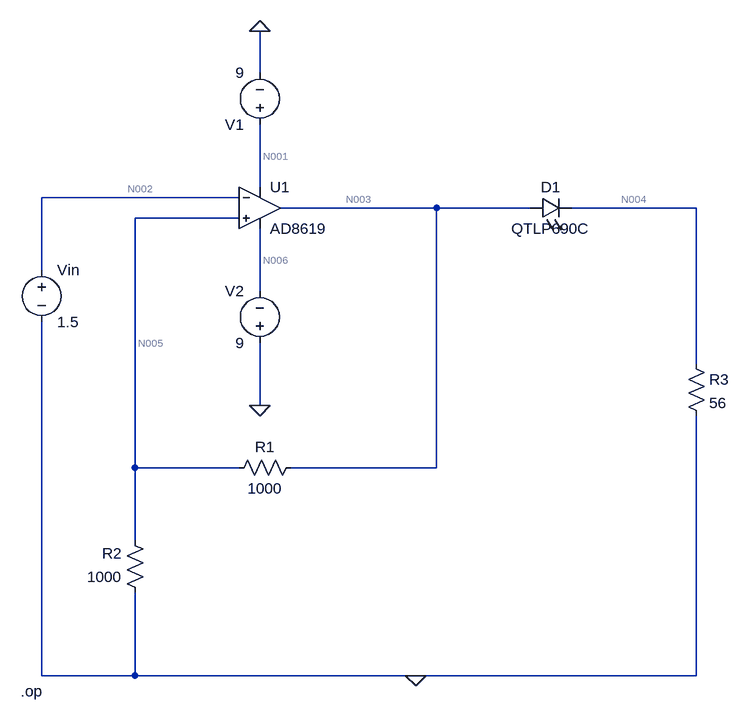
[diagram p0: schematic Circuit 5.asc]
Circuit 5.asc, the LTspice schematic file:
Version 4
SHEET 1 1448 904
WIRE -160 -64 -160 -128
WIRE -160 112 -160 16
WIRE -192 128 -496 128
WIRE 112 144 -128 144
WIRE 256 144 112 144
WIRE 512 144 320 144
WIRE -192 160 -352 160
WIRE -496 240 -496 128
WIRE -160 272 -160 176
WIRE 512 384 512 144
WIRE -160 448 -160 352
WIRE -352 544 -352 160
WIRE -192 544 -352 544
WIRE 112 544 112 144
WIRE 112 544 -112 544
WIRE -352 656 -352 544
WIRE -496 864 -496 320
WIRE -352 864 -352 736
WIRE -352 864 -496 864
WIRE 80 864 -352 864
WIRE 512 864 512 464
WIRE 512 864 80 864
FLAG -160 -128 0
FLAG -160 448 0
FLAG 80 864 0
SYMBOL OpAmps\\AD8619 -160 80 R0
SYMATTR InstName U1
SYMBOL voltage -160 32 R180
WINDOW 123 0 0 Left 0
WINDOW 39 0 0 Left 0
SYMATTR InstName V1
SYMATTR Value 9
SYMBOL voltage -160 368 R180
WINDOW 0 24 96 Left 2
WINDOW 3 24 16 Left 2
WINDOW 123 0 0 Left 0
WINDOW 39 0 0 Left 0
SYMATTR InstName V2
SYMATTR Value 9
SYMBOL voltage -496 224 R0
WINDOW 123 0 0 Left 0
WINDOW 39 0 0 Left 0
SYMATTR InstName Vin
SYMATTR Value 1.5
SYMBOL res -96 528 R90
WINDOW 0 0 56 VBottom 2
WINDOW 3 32 56 VTop 2
SYMATTR InstName R1
SYMATTR Value 1000
SYMBOL res -336 752 R180
WINDOW 0 36 76 Left 2
WINDOW 3 36 40 Left 2
SYMATTR InstName R2
SYMATTR Value 1000
SYMBOL LED 256 160 R270
WINDOW 0 32 32 VTop 2
WINDOW 3 0 32 VBottom 2
SYMATTR InstName D1
SYMATTR Value QTLP690C
SYMATTR Description Diode
SYMATTR Type diode
SYMBOL res 496 368 R0
SYMATTR InstName R3
SYMATTR Value 56
TEXT -528 888 Left 2 !.op

The netlist it stands for:
* Circuit 5.asc
XU1 N005 N002 N001 N006 N003 AD8619  ; pins In+ In- V+ V- OUT
V1 N001 0 9
V2 0 N006 9
Vin N002 0 1.5
R1 N003 N005 1000
R2 0 N005 1000
D1 N003 N004 QTLP690C
R3 N004 0 56
.model D D
.lib standard.dio
.op
.backanno
.end

* Results of the author's LTspice run, read from the files saved beside the schematic
* Operating Point:
*   V(n002) = 1.5 V
*   V(n006) = -9 V
*   V(n001) = 9 V
*   V(n005) = 1.501 V
*   V(n003) = 3.001 V
*   V(n004) = 1.074 V
*   I(D1) = 19.18 mA
*   I(R1) = 1.501 mA
*   I(R2) = -1.501 mA
*   I(R3) = 19.18 mA
*   I(V1) = -20.74 mA
*   I(V2) = -55.91 µA
*   I(Vin) = 50 fA
*   Ix(u1:1) = 50 fA
*   Ix(u1:2) = -50 fA
*   Ix(u1:99) = 20.74 mA
*   Ix(u1:50) = -55.91 µA
*   Ix(u1:45) = -20.69 mA
* From the log:
*   Semiconductor Device Operating Points:
*                           --- Diodes ---
*   Name:    d:u1:1      d:u1:2      d:u1:3      d:u1:4      d:u1:5
*   Model:    u1:dx       u1:dx       u1:dx       u1:dx     u1:dnoise
*   Id:     -6.72e-12   -9.81e-12   -1.03e-11   -8.09e-12    9.99e-04
*   Vd:     -6.71e+00   -9.80e+00   -1.03e+01   -8.08e+00    6.55e-01
*   Req:     1.00e+12    1.00e+12    1.00e+12    1.00e+12    2.59e+01
*   CAP:     0.00e+00    0.00e+00    0.00e+00    0.00e+00    0.00e+00
*   Name:      d1
*   Model:  qtlp690c
*   Id:      1.92e-02
*   Vd:      1.93e+00
*   Req:     2.02e+00
*   CAP:     1.63e-10
*                           --- MOSFET Transistors ---
*   Name:        m:u1:1      m:u1:2      m:u1:3      m:u1:4      m:u1:5
*   Model:       u1:pix      u1:pix      u1:nix      u1:nix      u1:pox
*   Id:         -2.36e-06   -2.64e-06    2.61e-06    2.39e-06   -2.07e-02
*   Vgs:        -5.26e-01   -5.27e-01    5.35e-01    5.33e-01   -2.42e+00
*   Vds:        -1.08e+01   -1.08e+01    7.82e+00    7.84e+00   -6.00e+00
*   Vbs:         0.00e+00    0.00e+00    0.00e+00    0.00e+00    0.00e+00
*   Vth:        -5.00e-01   -5.00e-01    5.00e-01    5.00e-01   -7.00e-01
*   Vdsat:      -2.55e-02   -2.70e-02    3.49e-02    3.34e-02   -1.72e+00
*   Gm:          1.85e-04    1.95e-04    1.50e-04    1.43e-04    2.40e-02
*   Gds:         2.26e-07    2.53e-07    6.94e-08    6.35e-08    1.35e-03
*   Gmb:         0.00e+00    0.00e+00    0.00e+00    0.00e+00    0.00e+00
*   Cbd:         0.00e+00    0.00e+00    0.00e+00    0.00e+00    0.00e+00
*   Cbs:         0.00e+00    0.00e+00    0.00e+00    0.00e+00    0.00e+00
*   Cgsov:       0.00e+00    0.00e+00    0.00e+00    0.00e+00    0.00e+00
*   Cgdov:       0.00e+00    0.00e+00    0.00e+00    0.00e+00    0.00e+00
*   Cgbov:       0.00e+00    0.00e+00    0.00e+00    0.00e+00    0.00e+00
*   Cgs:         5.46e-14    5.46e-14    2.04e-14    2.04e-14    5.76e-14
*   Cgd:         0.00e+00    0.00e+00    0.00e+00    0.00e+00    0.00e+00
*   Cgb:         0.00e+00    0.00e+00    0.00e+00    0.00e+00    0.00e+00
*   Name:        m:u1:6
*   Model:       u1:nox
*   Id:          2.40e-11
*   Vgs:        -1.04e+00
*   Vds:         1.20e+01
*   Vbs:         0.00e+00
*   Vth:         6.00e-01
*   Vdsat:       0.00e+00
*   Gm:          0.00e+00
*   Gds:         0.00e+00
*   Gmb:         0.00e+00
*   Cbd:         0.00e+00
*   Cbs:         0.00e+00
*   Cgsov:       0.00e+00
*   Cgdov:       0.00e+00
*   Cgbov:       0.00e+00
*   Cgs:         0.00e+00
*   Cgd:         0.00e+00
*   Cgb:         6.66e-13